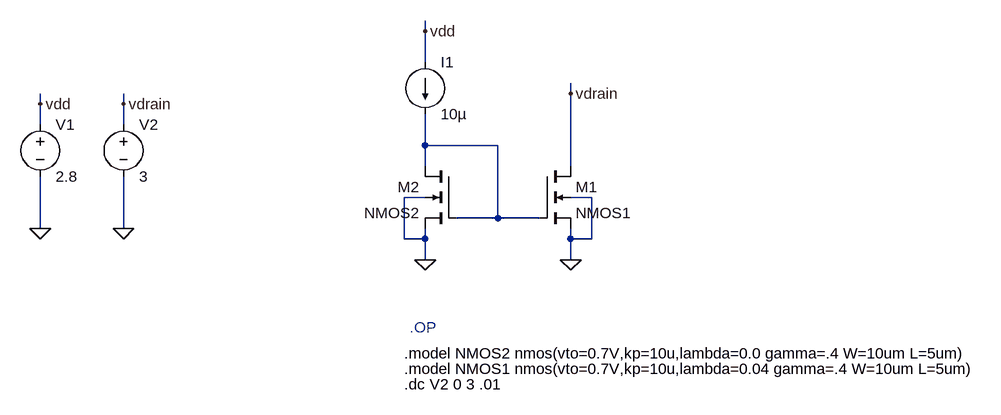
[diagram p0: schematic basic current source.asc]
basic current source.asc, the LTspice schematic file:
Version 4.1
SHEET 1 1016 680
WIRE 64 -80 64 -96
WIRE 64 -32 64 -80
WIRE 288 16 288 0
WIRE -528 32 -528 16
WIRE -400 32 -400 16
WIRE -528 64 -528 32
WIRE -400 64 -400 32
WIRE 64 96 64 48
WIRE 176 96 64 96
WIRE 64 128 64 96
WIRE 288 128 288 16
WIRE 64 176 32 176
WIRE 320 176 288 176
WIRE 176 208 176 96
WIRE 176 208 112 208
WIRE 240 208 176 208
WIRE -528 224 -528 144
WIRE -400 224 -400 144
WIRE 32 240 32 176
WIRE 64 240 64 224
WIRE 64 240 32 240
WIRE 288 240 288 224
WIRE 320 240 320 176
WIRE 320 240 288 240
WIRE 64 272 64 240
WIRE 288 272 288 240
FLAG 64 272 0
FLAG 288 272 0
FLAG 288 16 vdrain
FLAG 64 -80 vdd
FLAG -400 224 0
FLAG -528 224 0
FLAG -528 32 vdd
FLAG -400 32 vdrain
SYMBOL nmos4 240 128 R0
SYMATTR InstName M1
SYMATTR Value NMOS1
SYMBOL nmos4 112 128 M0
SYMATTR InstName M2
SYMATTR Value NMOS2
SYMBOL current 64 -32 R0
WINDOW 123 0 0 Left 0
WINDOW 39 0 0 Left 0
SYMATTR InstName I1
SYMATTR Value 10µ
SYMBOL voltage -528 48 R0
WINDOW 123 0 0 Left 0
WINDOW 39 0 0 Left 0
SYMATTR InstName V1
SYMATTR Value 2.8
SYMBOL voltage -400 48 R0
WINDOW 123 0 0 Left 0
WINDOW 39 0 0 Left 0
SYMATTR InstName V2
SYMATTR Value 3
TEXT 40 376 Left 2 ;.OP
TEXT 32 416 Left 2 !.model NMOS2 nmos(vto=0.7V,kp=10u,lambda=0.0 gamma=.4 W=10um L=5um)
TEXT 32 440 Left 2 !.model NMOS1 nmos(vto=0.7V,kp=10u,lambda=0.04 gamma=.4 W=10um L=5um)
TEXT 32 464 Left 2 !.dc V2 0 3 .01

The netlist it stands for:
* basic current source.asc
M1 vdrain N001 0 0 NMOS1
M2 N001 N001 0 0 NMOS2
I1 vdd N001 10µ
V1 vdd 0 2.8
V2 vdrain 0 3
.model NMOS NMOS
.model PMOS PMOS
.lib standard.mos
* .OP
.model NMOS2 nmos(vto=0.7V,kp=10u,lambda=0.0 gamma=.4 W=10um L=5um)
.model NMOS1 nmos(vto=0.7V,kp=10u,lambda=0.04 gamma=.4 W=10um L=5um)
.dc V2 0 3 .01
.backanno
.end